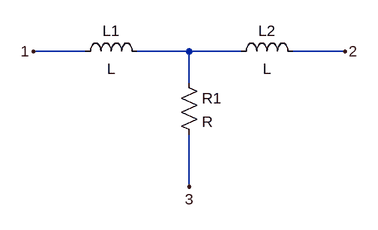
[diagram p0: schematic Red_T.asc]
Red_T.asc, the LTspice schematic file:
Version 4.1
SHEET 1 880 680
WIRE 64 128 -16 128
WIRE 224 128 144 128
WIRE 304 128 224 128
WIRE 464 128 384 128
WIRE 224 176 224 128
WIRE 224 336 224 256
FLAG -16 128 1
FLAG 464 128 2
FLAG 224 336 3
SYMBOL ind 48 144 R270
WINDOW 0 32 56 VTop 2
WINDOW 3 5 56 VBottom 2
SYMATTR InstName L1
SYMBOL ind 288 144 R270
WINDOW 0 32 56 VTop 2
WINDOW 3 5 56 VBottom 2
SYMATTR InstName L2
SYMBOL res 208 160 R0
SYMATTR InstName R1

The netlist it stands for:
* Red_T.asc
L1 1 N001 L
L2 N001 2 L
R1 N001 3 R
.backanno
.end